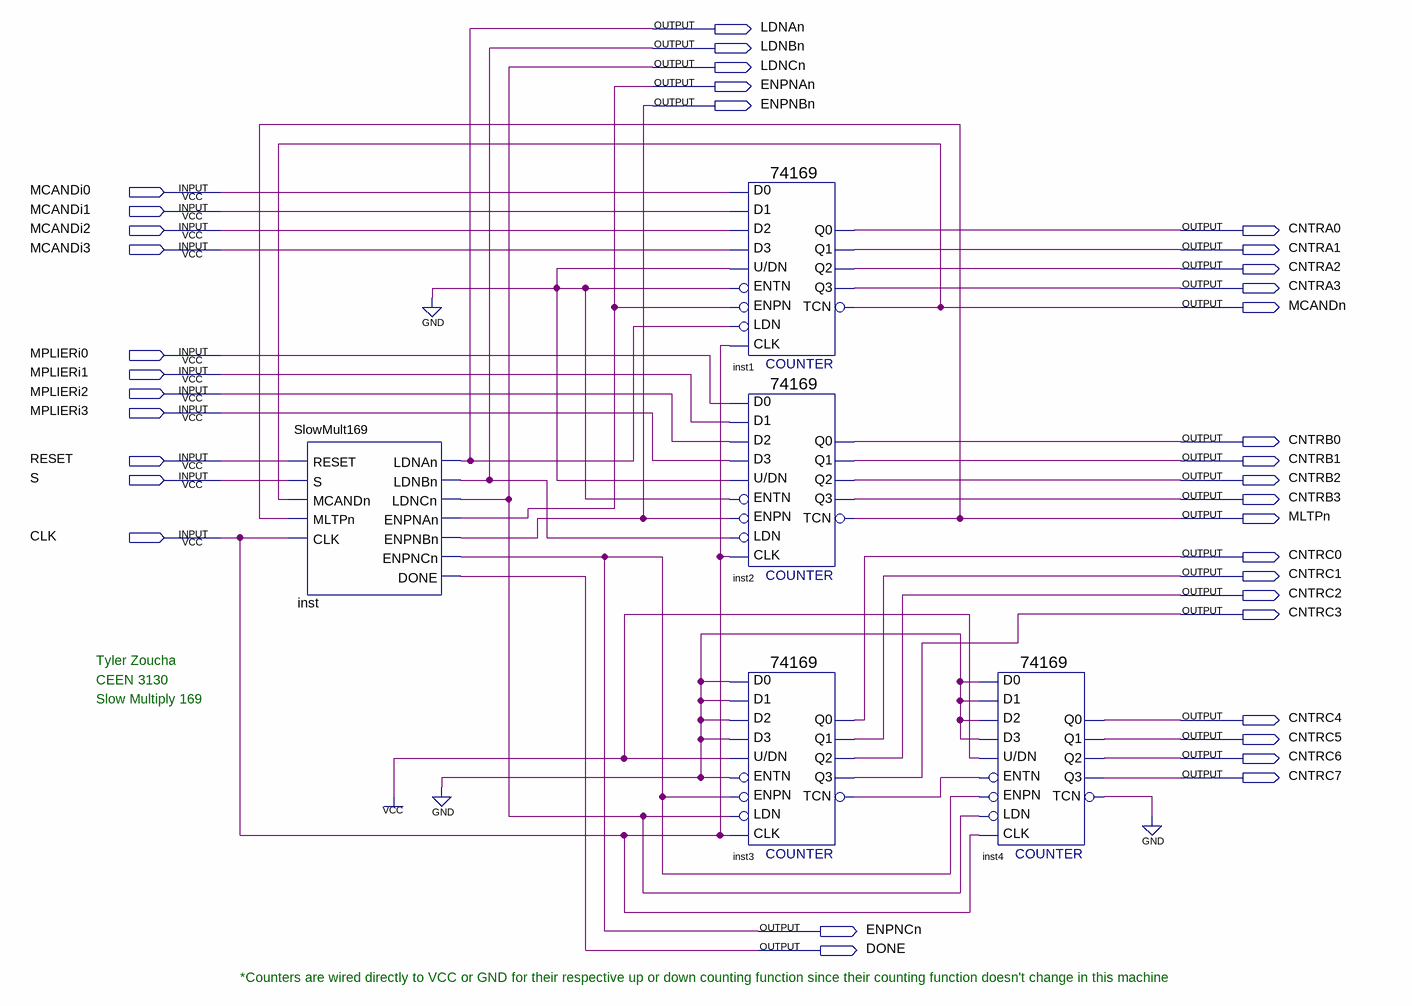
[diagram p0: schematic sheet]
// Quartus schematic Block1.bdf as structural Verilog: 5 symbols, 36 pins
module Block1 (
  input  MCANDi0,
  input  MCANDi1,
  input  MCANDi2,
  input  MCANDi3,
  input  MPLIERi0,
  input  MPLIERi1,
  input  MPLIERi2,
  input  MPLIERi3,
  input  RESET,
  input  S,
  input  CLK,
  output LDNAn,
  output LDNBn,
  output LDNCn,
  output ENPNAn,
  output ENPNBn,
  output CNTRA0,
  output CNTRA1,
  output CNTRA2,
  output CNTRA3,
  output MCANDn,
  output CNTRB0,
  output CNTRB1,
  output CNTRB2,
  output CNTRB3,
  output MLTPn,
  output CNTRC0,
  output CNTRC1,
  output CNTRC2,
  output CNTRC3,
  output CNTRC4,
  output CNTRC5,
  output CNTRC6,
  output CNTRC7,
  output ENPNCn,
  output DONE
);

  wire inst3_tcn, inst4_tcn;

  SlowMult169 inst (
    .RESET(RESET), .S(S), .MCANDn(MCANDn), .MLTPn(MLTPn), .CLK(CLK), .LDNAn(LDNAn), .LDNBn(LDNBn),
    .LDNCn(LDNCn), .ENPNAn(ENPNAn), .ENPNBn(ENPNBn), .ENPNCn(ENPNCn), .DONE(DONE));
  \74169  inst1 (
    .D1(MCANDi1), .D2(MCANDi2), .D0(MCANDi0), .ENTN(1'b0), .\U/DN (1'b0), .D3(MCANDi3), .LDN(LDNAn),
    .CLK(CLK), .ENPN(ENPNAn), .Q2(CNTRA2), .Q1(CNTRA1), .Q0(CNTRA0), .TCN(MCANDn), .Q3(CNTRA3));
  \74169  inst2 (
    .D1(MPLIERi1), .D2(MPLIERi2), .D0(MPLIERi0), .ENTN(1'b0), .\U/DN (1'b0), .D3(MPLIERi3), .LDN(LDNBn),
    .CLK(CLK), .ENPN(ENPNBn), .Q2(CNTRB2), .Q1(CNTRB1), .Q0(CNTRB0), .TCN(MLTPn), .Q3(CNTRB3));
  \74169  inst3 (
    .D1(1'b0), .D2(1'b0), .D0(1'b0), .ENTN(1'b0), .\U/DN (1'b1), .D3(1'b0), .LDN(LDNCn), .CLK(CLK),
    .ENPN(ENPNCn), .Q2(CNTRC2), .Q1(CNTRC1), .Q0(CNTRC0), .TCN(inst3_tcn), .Q3(CNTRC3));
  \74169  inst4 (
    .D1(1'b0), .D2(1'b0), .D0(1'b0), .ENTN(inst3_tcn), .\U/DN (1'b1), .D3(1'b0), .LDN(LDNCn), .CLK(CLK),
    .ENPN(ENPNCn), .Q2(CNTRC6), .Q1(CNTRC5), .Q0(CNTRC4), .TCN(inst4_tcn), .Q3(CNTRC7));
  // also tied to GND on the sheet: inst4_tcn

  // Notes on the sheet:
  //   Tyler Zoucha
  //   CEEN 3130
  //   Slow Multiply 169
  //   *Counters are wired directly to VCC or GND for their respective up or down counting function since their counting function doesn't change in this machine
endmodule
